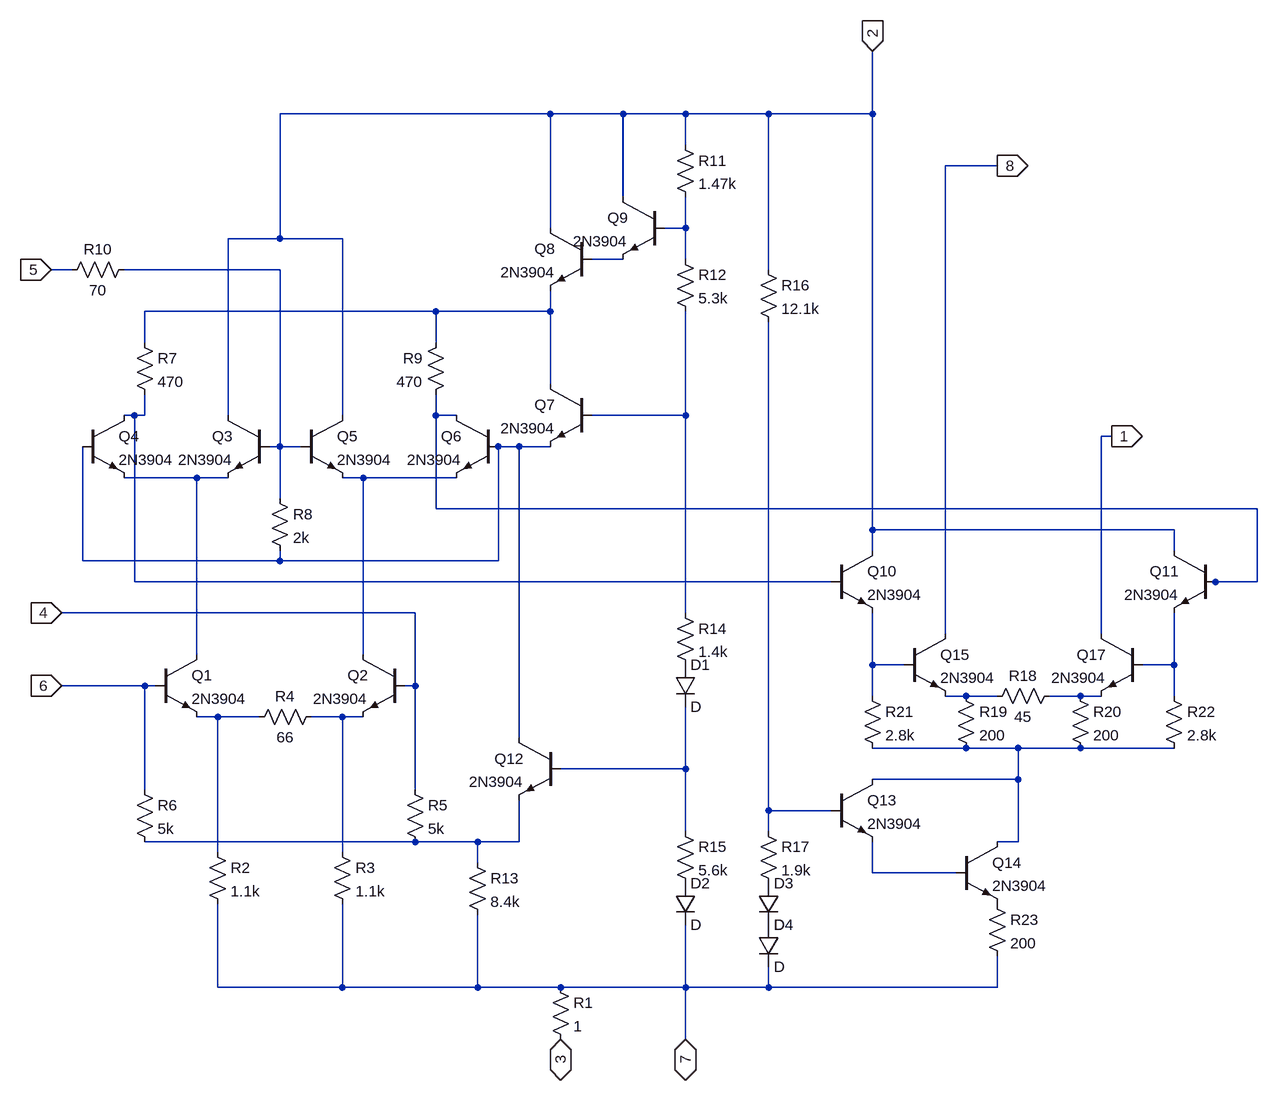
[diagram p0: schematic MC1350_v1.asc]
MC1350_v1.asc, the LTspice schematic file:
Version 4.1
SHEET 1 2180 940
WIRE 608 -576 192 -576
WIRE 720 -576 608 -576
WIRE 816 -576 720 -576
WIRE 944 -576 816 -576
WIRE 1104 -576 1104 -672
WIRE 1104 -576 944 -576
WIRE 816 -528 816 -576
WIRE 1296 -496 1216 -496
WIRE 720 -448 720 -576
WIRE 608 -400 608 -576
WIRE 816 -400 816 -448
WIRE 816 -400 784 -400
WIRE 192 -384 192 -576
WIRE 192 -384 112 -384
WIRE 288 -384 192 -384
WIRE 720 -352 672 -352
WIRE 816 -352 816 -400
WIRE -128 -336 -160 -336
WIRE 192 -336 -48 -336
WIRE 944 -336 944 -576
WIRE 432 -272 -16 -272
WIRE 608 -272 608 -304
WIRE 608 -272 432 -272
WIRE -16 -224 -16 -272
WIRE 432 -224 432 -272
WIRE 608 -160 608 -272
WIRE -32 -112 -48 -112
WIRE -16 -112 -16 -144
WIRE -16 -112 -32 -112
WIRE 112 -112 112 -384
WIRE 288 -112 288 -384
WIRE 432 -112 432 -144
WIRE 464 -112 432 -112
WIRE 816 -112 816 -272
WIRE 816 -112 672 -112
WIRE 1472 -80 1456 -80
WIRE 192 -64 192 -336
WIRE 192 -64 176 -64
WIRE 224 -64 192 -64
WIRE 528 -64 512 -64
WIRE 560 -64 528 -64
WIRE 608 -64 560 -64
WIRE 64 -16 -48 -16
WIRE 112 -16 64 -16
WIRE 320 -16 288 -16
WIRE 464 -16 320 -16
WIRE 192 16 192 -64
WIRE 432 32 432 -112
WIRE 1696 32 432 32
WIRE 1104 64 1104 -576
WIRE 1568 64 1104 64
WIRE 1104 96 1104 64
WIRE 1568 96 1568 64
WIRE -112 112 -112 -64
WIRE 192 112 192 96
WIRE 192 112 -112 112
WIRE 528 112 528 -64
WIRE 528 112 192 112
WIRE -32 144 -32 -112
WIRE 1040 144 -32 144
WIRE 1632 144 1616 144
WIRE 1696 144 1696 32
WIRE 1696 144 1632 144
WIRE 400 192 -144 192
WIRE 816 192 816 -112
WIRE 1216 224 1216 -496
WIRE 1456 224 1456 -80
WIRE 64 256 64 -16
WIRE 320 256 320 -16
WIRE 1104 272 1104 192
WIRE 1152 272 1104 272
WIRE 1568 272 1568 192
WIRE 1568 272 1520 272
WIRE -16 304 -144 304
WIRE 0 304 -16 304
WIRE 400 304 400 192
WIRE 400 304 384 304
WIRE 1104 320 1104 272
WIRE 1248 320 1216 320
WIRE 1296 320 1248 320
WIRE 1424 320 1376 320
WIRE 1456 320 1424 320
WIRE 1568 320 1568 272
WIRE 96 352 64 352
WIRE 160 352 96 352
WIRE 288 352 240 352
WIRE 320 352 288 352
WIRE 560 384 560 -64
WIRE 1248 400 1104 400
WIRE 1328 400 1248 400
WIRE 1424 400 1328 400
WIRE 1568 400 1424 400
WIRE 816 432 816 336
WIRE 816 432 624 432
WIRE 1328 448 1328 400
WIRE 1328 448 1104 448
WIRE -16 464 -16 304
WIRE 400 464 400 304
WIRE 944 496 944 -256
WIRE 1040 496 944 496
WIRE 816 528 816 432
WIRE 944 528 944 496
WIRE 400 544 -16 544
WIRE 496 544 400 544
WIRE 560 544 560 480
WIRE 560 544 496 544
WIRE 1328 544 1328 448
WIRE 1328 544 1296 544
WIRE 96 560 96 352
WIRE 288 560 288 352
WIRE 496 576 496 544
WIRE 1104 592 1104 544
WIRE 1232 592 1104 592
WIRE 96 768 96 640
WIRE 288 768 288 640
WIRE 288 768 96 768
WIRE 496 768 496 656
WIRE 496 768 288 768
WIRE 624 768 496 768
WIRE 816 768 816 672
WIRE 816 768 624 768
WIRE 944 768 944 736
WIRE 944 768 816 768
WIRE 1296 768 1296 720
WIRE 1296 768 944 768
WIRE 816 848 816 768
FLAG -144 304 6
IOPIN -144 304 In
FLAG 816 848 7
IOPIN 816 848 BiDir
FLAG -144 192 4
IOPIN -144 192 In
FLAG -160 -336 5
IOPIN -160 -336 In
FLAG 1104 -672 2
IOPIN 1104 -672 In
FLAG 1296 -496 8
IOPIN 1296 -496 Out
FLAG 1472 -80 1
IOPIN 1472 -80 Out
FLAG 624 848 3
IOPIN 624 848 BiDir
SYMBOL res 80 544 R0
SYMATTR InstName R2
SYMATTR Value 1.1k
SYMBOL npn 0 256 R0
SYMATTR InstName Q1
SYMATTR Value 2N3904
SYMBOL npn 384 256 M0
SYMATTR InstName Q2
SYMATTR Value 2N3904
SYMBOL res 272 544 R0
SYMATTR InstName R3
SYMATTR Value 1.1k
SYMBOL res 256 336 R90
WINDOW 0 0 56 VBottom 2
WINDOW 3 32 56 VTop 2
SYMATTR InstName R4
SYMATTR Value 66
SYMBOL res 384 448 R0
SYMATTR InstName R5
SYMATTR Value 5k
SYMBOL res -32 448 R0
SYMATTR InstName R6
SYMATTR Value 5k
SYMBOL npn 176 -112 M0
SYMATTR InstName Q3
SYMATTR Value 2N3904
SYMBOL npn -112 -112 R0
SYMATTR InstName Q4
SYMATTR Value 2N3904
SYMBOL res -32 -240 R0
SYMATTR InstName R7
SYMATTR Value 470
SYMBOL res 176 0 R0
SYMATTR InstName R8
SYMATTR Value 2k
SYMBOL npn 224 -112 R0
SYMATTR InstName Q5
SYMATTR Value 2N3904
SYMBOL npn 528 -112 M0
SYMATTR InstName Q6
SYMATTR Value 2N3904
SYMBOL res 448 -240 M0
SYMATTR InstName R9
SYMATTR Value 470
SYMBOL res -32 -352 R90
WINDOW 0 0 56 VBottom 2
WINDOW 3 32 56 VTop 2
SYMATTR InstName R10
SYMATTR Value 70
SYMBOL npn 672 -160 M0
SYMATTR InstName Q7
SYMATTR Value 2N3904
SYMBOL npn 672 -400 M0
SYMATTR InstName Q8
SYMATTR Value 2N3904
SYMBOL npn 784 -448 M0
SYMATTR InstName Q9
SYMATTR Value 2N3904
SYMBOL res 800 -544 R0
SYMATTR InstName R11
SYMATTR Value 1.47k
SYMBOL res 800 -368 R0
SYMATTR InstName R12
SYMATTR Value 5.3k
SYMBOL npn 1040 96 R0
SYMATTR InstName Q10
SYMATTR Value 2N3904
SYMBOL npn 1632 96 M0
SYMATTR InstName Q11
SYMATTR Value 2N3904
SYMBOL npn 624 384 M0
SYMATTR InstName Q12
SYMATTR Value 2N3904
SYMBOL res 480 560 R0
SYMATTR InstName R13
SYMATTR Value 8.4k
SYMBOL res 800 176 R0
SYMATTR InstName R14
SYMATTR Value 1.4k
SYMBOL diode 800 272 R0
SYMATTR InstName D1
SYMBOL res 800 512 R0
SYMATTR InstName R15
SYMATTR Value 5.6k
SYMBOL diode 800 608 R0
SYMATTR InstName D2
SYMBOL res 928 -352 R0
SYMATTR InstName R16
SYMATTR Value 12.1k
SYMBOL res 928 512 R0
SYMATTR InstName R17
SYMATTR Value 1.9k
SYMBOL diode 928 608 R0
SYMATTR InstName D3
SYMBOL diode 928 672 R0
SYMATTR InstName D4
SYMBOL npn 1040 448 R0
SYMATTR InstName Q13
SYMATTR Value 2N3904
SYMBOL npn 1232 544 R0
SYMATTR InstName Q14
SYMATTR Value 2N3904
SYMBOL npn 1152 224 R0
SYMATTR InstName Q15
SYMATTR Value 2N3904
SYMBOL res 1392 304 R90
WINDOW 0 0 56 VBottom 2
WINDOW 3 32 56 VTop 2
SYMATTR InstName R18
SYMATTR Value 45
SYMBOL npn 1520 224 M0
SYMATTR InstName Q17
SYMATTR Value 2N3904
SYMBOL res 1232 304 R0
SYMATTR InstName R19
SYMATTR Value 200
SYMBOL res 1408 304 R0
SYMATTR InstName R20
SYMATTR Value 200
SYMBOL res 1088 304 R0
SYMATTR InstName R21
SYMATTR Value 2.8k
SYMBOL res 1552 304 R0
SYMATTR InstName R22
SYMATTR Value 2.8k
SYMBOL res 1280 624 R0
SYMATTR InstName R23
SYMATTR Value 200
SYMBOL res 608 752 R0
SYMATTR InstName R1
SYMATTR Value 1

The netlist it stands for:
* MC1350_v1.asc
R2 N015 7 1.1k
Q1 N009 6 N015 0 2N3904
Q2 N010 4 N016 0 2N3904
R3 N016 7 1.1k
R4 N016 N015 66
R5 4 N020 5k
R6 6 N020 5k
Q3 2 N003 N009 0 2N3904
Q4 N005 N008 N009 0 2N3904
R7 N004 N005 470
R8 N003 N008 2k
Q5 2 N003 N010 0 2N3904
Q6 N006 N008 N010 0 2N3904
R9 N004 N006 470
R10 N003 5 70
Q7 N004 N007 N008 0 2N3904
Q8 2 N002 N004 0 2N3904
Q9 2 N001 N002 0 2N3904
R11 2 N001 1.47k
R12 N001 N007 5.3k
Q10 2 N005 N011 0 2N3904
Q11 2 N006 N012 0 2N3904
Q12 N008 N018 N020 0 2N3904
R13 N020 7 8.4k
R14 N007 P001 1.4k
D1 P001 N018 D
R15 N018 P002 5.6k
D2 P002 7 D
R16 2 N019 12.1k
R17 N019 P003 1.9k
D3 P003 P004 D
D4 P004 7 D
Q13 N017 N019 N021 0 2N3904
Q14 N017 N021 P005 0 2N3904
Q15 8 N011 N013 0 2N3904
R18 N014 N013 45
Q17 1 N012 N014 0 2N3904
R19 N013 N017 200
R20 N014 N017 200
R21 N011 N017 2.8k
R22 N012 N017 2.8k
R23 P005 7 200
R1 7 3 1
.model D D
.lib standard.dio
.model NPN NPN
.model PNP PNP
.lib standard.bjt
.backanno
.end